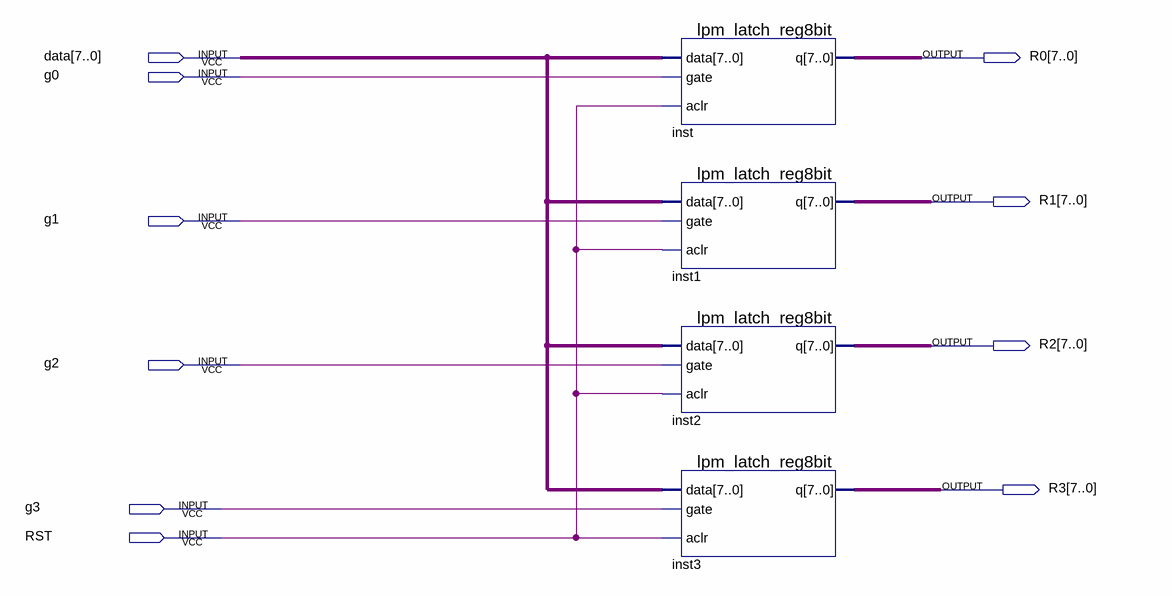
[diagram p0: schematic sheet]
// Quartus schematic FourRegister.bdf as structural Verilog: 4 symbols, 10 pins
module FourRegister (
  input  [7:0] data,
  input  g0,
  input  g1,
  input  g2,
  input  g3,
  input  RST,
  output [7:0] R0,
  output [7:0] R1,
  output [7:0] R2,
  output [7:0] R3
);

  lpm_latch_reg8bit inst (.data(data), .gate(g0), .aclr(RST), .q(R0));
  lpm_latch_reg8bit inst1 (.data(data), .gate(g1), .aclr(RST), .q(R1));
  lpm_latch_reg8bit inst2 (.data(data), .gate(g2), .aclr(RST), .q(R2));
  lpm_latch_reg8bit inst3 (.data(data), .gate(g3), .aclr(RST), .q(R3));
endmodule
